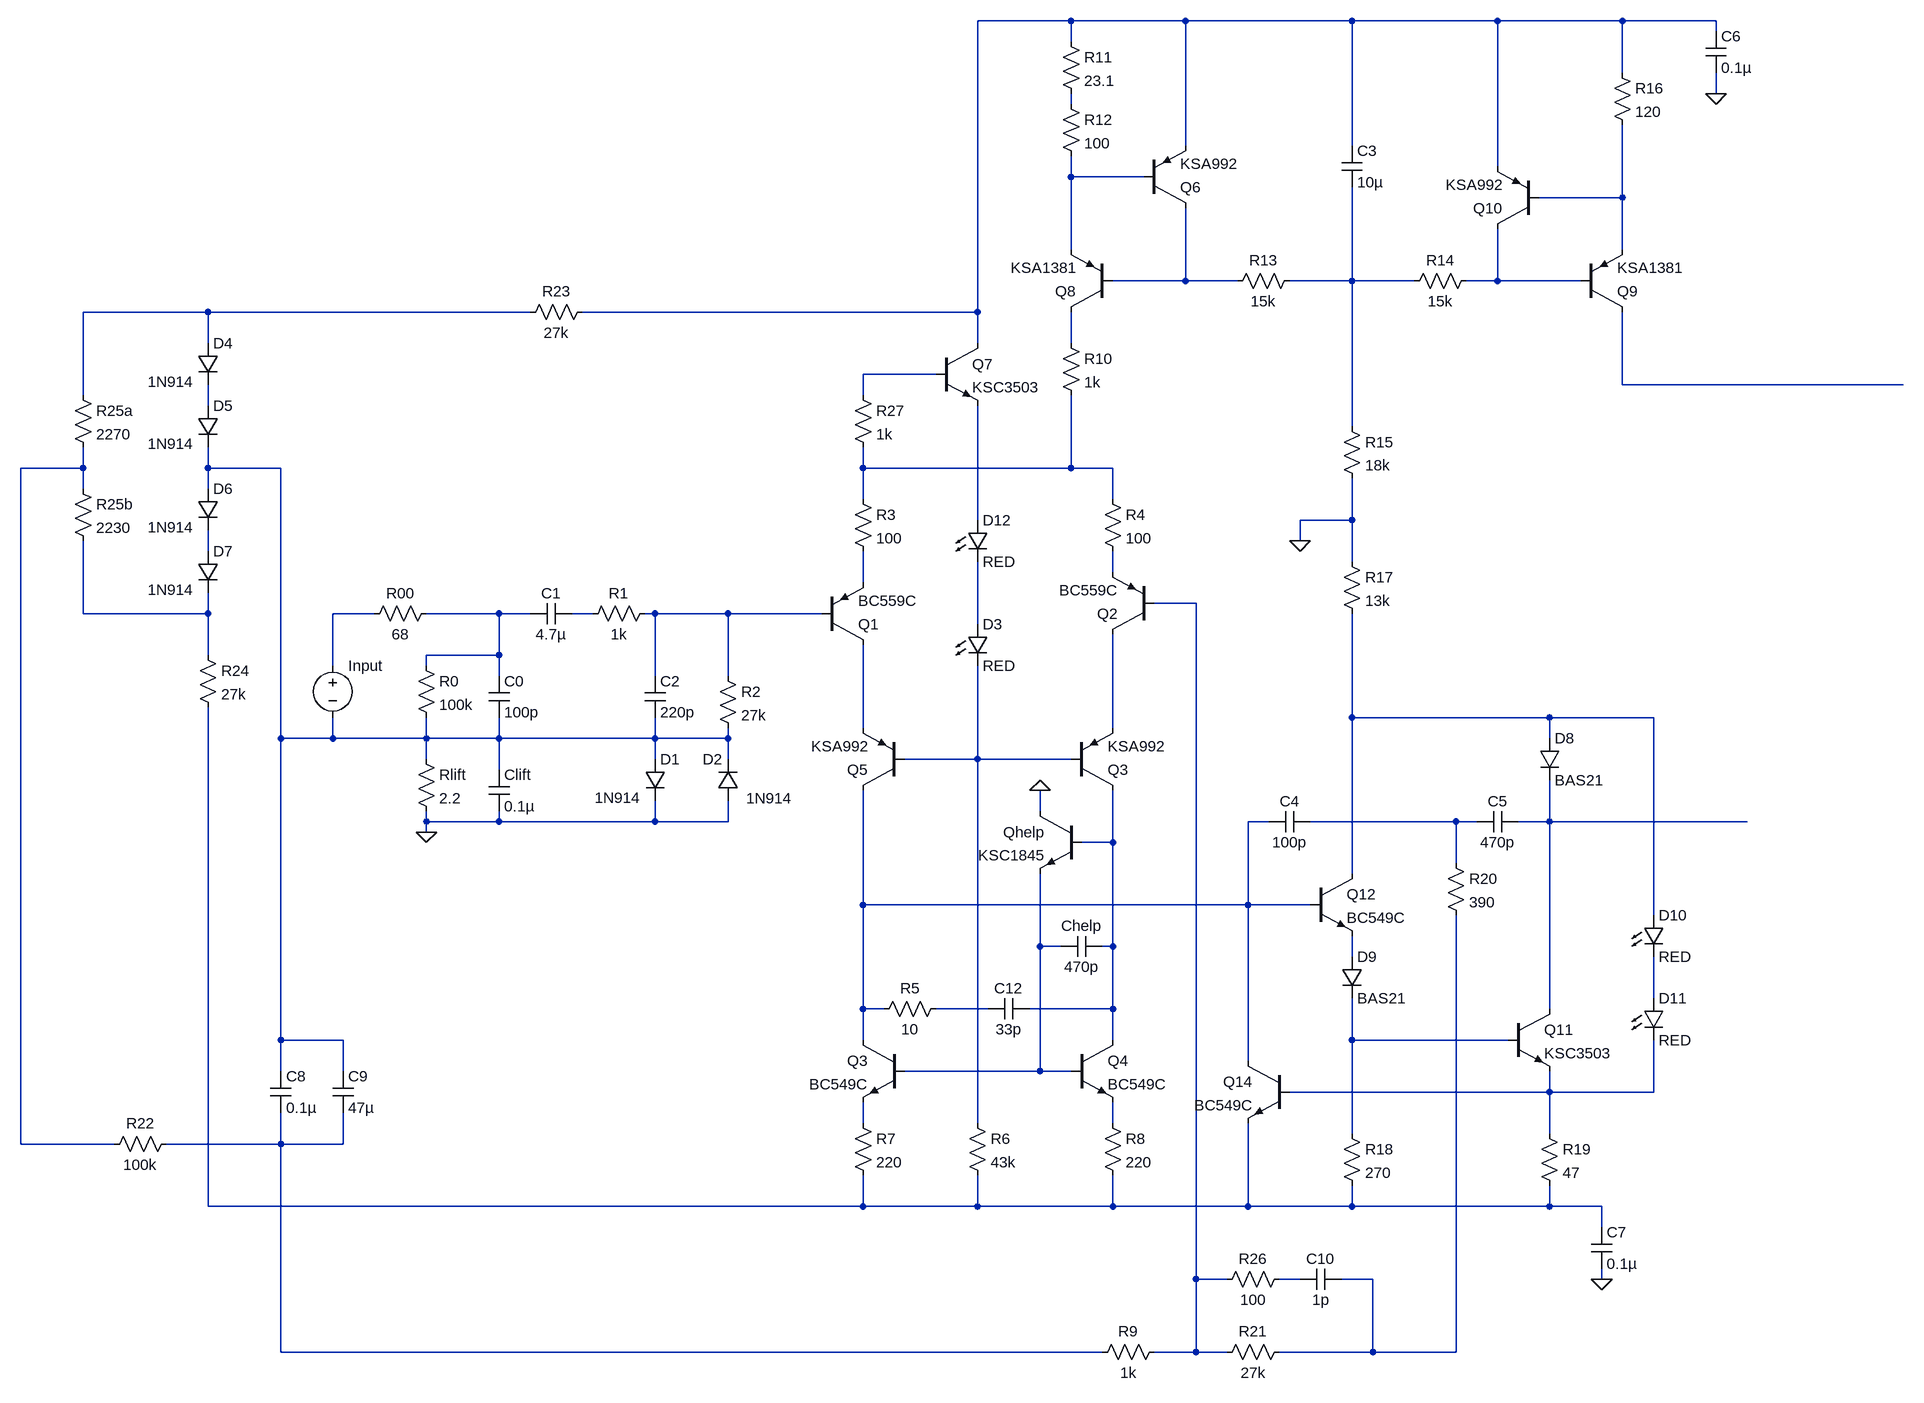
[diagram p0: schematic Wolverine.asc]
Wolverine.asc, the LTspice schematic file:
Version 4
SHEET 1 2548 1248
WIRE 1264 -848 1120 -848
WIRE 1440 -848 1264 -848
WIRE 1696 -848 1440 -848
WIRE 1920 -848 1696 -848
WIRE 2112 -848 1920 -848
WIRE 2256 -848 2112 -848
WIRE 2256 -832 2256 -848
WIRE 1264 -816 1264 -848
WIRE 2112 -768 2112 -848
WIRE 2256 -736 2256 -768
WIRE 1264 -720 1264 -736
WIRE 1440 -656 1440 -848
WIRE 1696 -656 1696 -848
WIRE 1920 -624 1920 -848
WIRE 1264 -608 1264 -640
WIRE 1376 -608 1264 -608
WIRE 2112 -576 2112 -688
WIRE 2112 -576 1984 -576
WIRE 1264 -496 1264 -608
WIRE 2112 -496 2112 -576
WIRE 1440 -448 1440 -560
WIRE 1440 -448 1328 -448
WIRE 1520 -448 1440 -448
WIRE 1696 -448 1696 -592
WIRE 1696 -448 1600 -448
WIRE 1792 -448 1696 -448
WIRE 1920 -448 1920 -528
WIRE 1920 -448 1872 -448
WIRE 2048 -448 1920 -448
WIRE -64 -400 -256 -400
WIRE 432 -400 -64 -400
WIRE 1120 -400 1120 -848
WIRE 1120 -400 512 -400
WIRE -64 -352 -64 -400
WIRE 1120 -352 1120 -400
WIRE 1264 -352 1264 -400
WIRE 1056 -304 944 -304
WIRE 2112 -288 2112 -400
WIRE 2544 -288 2112 -288
WIRE -256 -272 -256 -400
WIRE 944 -272 944 -304
WIRE -64 -256 -64 -288
WIRE 1696 -224 1696 -448
WIRE -256 -160 -256 -192
WIRE -256 -160 -352 -160
WIRE -64 -160 -64 -192
WIRE 48 -160 -64 -160
WIRE 944 -160 944 -192
WIRE 1264 -160 1264 -272
WIRE 1264 -160 944 -160
WIRE 1328 -160 1264 -160
WIRE -256 -128 -256 -160
WIRE -64 -128 -64 -160
WIRE 944 -112 944 -160
WIRE 1328 -112 1328 -160
WIRE 1120 -80 1120 -256
WIRE 1696 -80 1696 -144
WIRE 1696 -80 1616 -80
WIRE 1616 -48 1616 -80
WIRE -64 -32 -64 -64
WIRE 1696 -16 1696 -80
WIRE 1328 0 1328 -32
WIRE 944 16 944 -32
WIRE 1456 48 1392 48
WIRE -256 64 -256 -48
WIRE -64 64 -64 32
WIRE -64 64 -256 64
WIRE 192 64 128 64
WIRE 384 64 272 64
WIRE 432 64 384 64
WIRE 528 64 496 64
WIRE 624 64 608 64
WIRE 736 64 624 64
WIRE 880 64 736 64
WIRE 1120 80 1120 -16
WIRE -64 128 -64 64
WIRE 384 128 384 64
WIRE 384 128 272 128
WIRE 128 144 128 64
WIRE 272 144 272 128
WIRE 384 160 384 128
WIRE 624 160 624 64
WIRE 736 160 736 64
WIRE 1696 224 1696 64
WIRE 2000 224 1696 224
WIRE 2160 224 2000 224
WIRE 944 240 944 112
WIRE 1328 240 1328 96
WIRE 48 256 48 -160
WIRE 128 256 128 224
WIRE 128 256 48 256
WIRE 272 256 272 224
WIRE 272 256 128 256
WIRE 384 256 384 224
WIRE 384 256 272 256
WIRE 624 256 624 224
WIRE 624 256 384 256
WIRE 736 256 736 240
WIRE 736 256 624 256
WIRE 2000 256 2000 224
WIRE 272 288 272 256
WIRE 624 288 624 256
WIRE 736 288 736 256
WIRE 1120 288 1120 144
WIRE 1120 288 1008 288
WIRE 1264 288 1120 288
WIRE 384 304 384 256
WIRE 1216 368 1216 336
WIRE 272 384 272 368
WIRE 384 384 384 368
WIRE 384 384 272 384
WIRE 624 384 624 352
WIRE 624 384 384 384
WIRE 736 384 736 352
WIRE 736 384 624 384
WIRE 1568 384 1536 384
WIRE 1856 384 1632 384
WIRE 1888 384 1856 384
WIRE 2000 384 2000 320
WIRE 2000 384 1952 384
WIRE 2304 384 2000 384
WIRE 272 400 272 384
WIRE 1328 416 1328 336
WIRE 1328 416 1280 416
WIRE 1856 448 1856 384
WIRE 1696 464 1696 224
WIRE 944 512 944 336
WIRE 1536 512 1536 384
WIRE 1536 512 944 512
WIRE 1632 512 1536 512
WIRE 2160 528 2160 224
WIRE 1216 576 1216 464
WIRE 1248 576 1216 576
WIRE 1328 576 1328 416
WIRE 1328 576 1312 576
WIRE 1696 592 1696 560
WIRE 2160 656 2160 592
WIRE 944 672 944 512
WIRE 976 672 944 672
WIRE 1136 672 1056 672
WIRE 1328 672 1328 576
WIRE 1328 672 1200 672
WIRE 2000 672 2000 384
WIRE 48 720 48 256
WIRE 144 720 48 720
WIRE 944 720 944 672
WIRE 1328 720 1328 672
WIRE 1696 720 1696 656
WIRE 1936 720 1696 720
WIRE 1536 752 1536 512
WIRE 48 768 48 720
WIRE 144 768 144 720
WIRE 1216 768 1216 576
WIRE 1216 768 1008 768
WIRE 1264 768 1216 768
WIRE 2000 800 2000 768
WIRE 2000 800 1600 800
WIRE 2160 800 2160 720
WIRE 2160 800 2000 800
WIRE 944 848 944 816
WIRE 1120 848 1120 288
WIRE 1328 848 1328 816
WIRE 1696 864 1696 720
WIRE 2000 864 2000 800
WIRE -352 880 -352 -160
WIRE -208 880 -352 880
WIRE 48 880 48 832
WIRE 48 880 -128 880
WIRE 144 880 144 832
WIRE 144 880 48 880
WIRE -64 976 -64 208
WIRE 944 976 944 928
WIRE 944 976 -64 976
WIRE 1120 976 1120 928
WIRE 1120 976 944 976
WIRE 1328 976 1328 928
WIRE 1328 976 1120 976
WIRE 1536 976 1536 848
WIRE 1536 976 1328 976
WIRE 1696 976 1696 944
WIRE 1696 976 1536 976
WIRE 2000 976 2000 944
WIRE 2000 976 1696 976
WIRE 2080 976 2000 976
WIRE 2080 1008 2080 976
WIRE 1456 1088 1456 48
WIRE 1504 1088 1456 1088
WIRE 1616 1088 1584 1088
WIRE 1728 1088 1680 1088
WIRE 2080 1088 2080 1072
WIRE 48 1200 48 880
WIRE 1312 1200 48 1200
WIRE 1456 1200 1456 1088
WIRE 1456 1200 1392 1200
WIRE 1504 1200 1456 1200
WIRE 1728 1200 1728 1088
WIRE 1728 1200 1584 1200
WIRE 1856 1200 1856 528
WIRE 1856 1200 1728 1200
FLAG 272 400 0
FLAG 1216 336 0
FLAG 1616 -48 0
FLAG 2256 -736 0
FLAG 2080 1088 0
SYMBOL voltage 128 128 R0
WINDOW 3 24 96 Invisible 2
WINDOW 123 0 0 Left 0
WINDOW 39 0 0 Left 0
SYMATTR InstName Input
SYMATTR Value SINE(0 1 1k)
SYMBOL res 288 48 R90
WINDOW 0 0 56 VBottom 2
WINDOW 3 32 56 VTop 2
SYMATTR InstName R00
SYMATTR Value 68
SYMBOL res 256 128 R0
SYMATTR InstName R0
SYMATTR Value 100k
SYMBOL cap 368 160 R0
SYMATTR InstName C0
SYMATTR Value 100p
SYMBOL cap 496 48 R90
WINDOW 0 0 32 VBottom 2
WINDOW 3 32 32 VTop 2
SYMATTR InstName C1
SYMATTR Value 4.7µ
SYMBOL res 624 48 R90
WINDOW 0 0 56 VBottom 2
WINDOW 3 32 56 VTop 2
SYMATTR InstName R1
SYMATTR Value 1k
SYMBOL cap 608 160 R0
SYMATTR InstName C2
SYMATTR Value 220p
SYMBOL res 720 144 R0
SYMATTR InstName R2
SYMATTR Value 27k
SYMBOL pnp 880 112 M180
SYMATTR InstName Q1
SYMATTR Value BC559C
SYMBOL res 256 272 R0
SYMATTR InstName Rlift
SYMATTR Value 2.2
SYMBOL cap 368 304 R0
SYMATTR InstName Clift
SYMATTR Value 0.1µ
SYMBOL diode 608 288 R0
WINDOW 3 -77 59 Left 2
SYMATTR InstName D1
SYMATTR Value 1N914
SYMBOL diode 752 352 R180
WINDOW 0 24 64 Left 2
WINDOW 3 -83 4 Left 2
SYMATTR InstName D2
SYMATTR Value 1N914
SYMBOL pnp 1008 336 R180
SYMATTR InstName Q5
SYMATTR Value KSA992
SYMBOL res 928 -128 R0
SYMATTR InstName R3
SYMATTR Value 100
SYMBOL pnp 1392 96 R180
SYMATTR InstName Q2
SYMATTR Value BC559C
SYMBOL pnp 1264 336 M180
SYMATTR InstName Q3
SYMATTR Value KSA992
SYMBOL res 1312 -128 R0
SYMATTR InstName R4
SYMATTR Value 100
SYMBOL npn 1056 -352 R0
SYMATTR InstName Q7
SYMATTR Value KSC3503
SYMBOL res 928 -288 R0
SYMATTR InstName R27
SYMATTR Value 1k
SYMBOL LED 1104 -80 R0
SYMATTR InstName D12
SYMATTR Value RED
SYMATTR Description Diode
SYMATTR Type diode
SYMBOL LED 1104 80 R0
SYMATTR InstName D3
SYMATTR Value RED
SYMATTR Description Diode
SYMATTR Type diode
SYMBOL npn 1280 368 M0
SYMATTR InstName Qhelp
SYMATTR Value KSC1845
SYMBOL cap 1312 560 R90
WINDOW 0 0 32 VBottom 2
WINDOW 3 32 32 VTop 2
SYMATTR InstName Chelp
SYMATTR Value 470p
SYMBOL res 1072 656 R90
WINDOW 0 0 56 VBottom 2
WINDOW 3 32 56 VTop 2
SYMATTR InstName R5
SYMATTR Value 10
SYMBOL cap 1200 656 R90
WINDOW 0 0 32 VBottom 2
WINDOW 3 32 32 VTop 2
SYMATTR InstName C12
SYMATTR Value 33p
SYMBOL npn 1008 720 M0
SYMATTR InstName Q3
SYMATTR Value BC549C
SYMBOL npn 1264 720 R0
SYMATTR InstName Q4
SYMATTR Value BC549C
SYMBOL res 928 832 R0
SYMATTR InstName R7
SYMATTR Value 220
SYMBOL res 1312 832 R0
SYMATTR InstName R8
SYMATTR Value 220
SYMBOL res 1104 832 R0
SYMATTR InstName R6
SYMATTR Value 43k
SYMBOL res 1248 -368 R0
SYMATTR InstName R10
SYMATTR Value 1k
SYMBOL pnp 1328 -400 R180
SYMATTR InstName Q8
SYMATTR Value KSA1381
SYMBOL pnp 1376 -560 M180
SYMATTR InstName Q6
SYMATTR Value KSA992
SYMBOL res 1248 -736 R0
SYMATTR InstName R12
SYMATTR Value 100
SYMBOL res 1248 -832 R0
SYMATTR InstName R11
SYMATTR Value 23.1
SYMBOL res 528 -416 R90
WINDOW 0 0 56 VBottom 2
WINDOW 3 32 56 VTop 2
SYMATTR InstName R23
SYMATTR Value 27k
SYMBOL npn 1632 464 R0
SYMATTR InstName Q12
SYMATTR Value BC549C
SYMBOL diode 1680 592 R0
SYMATTR InstName D9
SYMATTR Value BAS21
SYMBOL cap 1632 368 R90
WINDOW 0 0 32 VBottom 2
WINDOW 3 32 32 VTop 2
SYMATTR InstName C4
SYMATTR Value 100p
SYMBOL res 1680 -32 R0
SYMATTR InstName R17
SYMATTR Value 13k
SYMBOL res 1680 -240 R0
SYMATTR InstName R15
SYMATTR Value 18k
SYMBOL res 1616 -464 R90
WINDOW 0 0 56 VBottom 2
WINDOW 3 32 56 VTop 2
SYMATTR InstName R13
SYMATTR Value 15k
SYMBOL cap 1680 -656 R0
SYMATTR InstName C3
SYMATTR Value 10µ
SYMBOL res 1888 -464 R90
WINDOW 0 0 56 VBottom 2
WINDOW 3 32 56 VTop 2
SYMATTR InstName R14
SYMATTR Value 15k
SYMBOL pnp 1984 -528 R180
SYMATTR InstName Q10
SYMATTR Value KSA992
SYMBOL pnp 2048 -400 M180
SYMATTR InstName Q9
SYMATTR Value KSA1381
SYMBOL res 2096 -784 R0
SYMATTR InstName R16
SYMATTR Value 120
SYMBOL cap 2240 -832 R0
SYMATTR InstName C6
SYMATTR Value 0.1µ
SYMBOL npn 1600 752 M0
SYMATTR InstName Q14
SYMATTR Value BC549C
SYMBOL res 1680 848 R0
SYMATTR InstName R18
SYMATTR Value 270
SYMBOL npn 1936 672 R0
SYMATTR InstName Q11
SYMATTR Value KSC3503
SYMBOL res 1840 432 R0
SYMATTR InstName R20
SYMATTR Value 390
SYMBOL res 1984 848 R0
SYMATTR InstName R19
SYMATTR Value 47
SYMBOL LED 2144 656 R0
SYMATTR InstName D11
SYMATTR Value RED
SYMATTR Description Diode
SYMATTR Type diode
SYMBOL LED 2144 528 R0
SYMATTR InstName D10
SYMATTR Value RED
SYMATTR Description Diode
SYMATTR Type diode
SYMBOL cap 1952 368 R90
WINDOW 0 0 32 VBottom 2
WINDOW 3 32 32 VTop 2
SYMATTR InstName C5
SYMATTR Value 470p
SYMBOL diode 1984 256 R0
SYMATTR InstName D8
SYMATTR Value BAS21
SYMBOL res 1600 1072 R90
WINDOW 0 0 56 VBottom 2
WINDOW 3 32 56 VTop 2
SYMATTR InstName R26
SYMATTR Value 100
SYMBOL cap 1680 1072 R90
WINDOW 0 0 32 VBottom 2
WINDOW 3 32 32 VTop 2
SYMATTR InstName C10
SYMATTR Value 1p
SYMBOL res 1600 1184 R90
WINDOW 0 0 56 VBottom 2
WINDOW 3 32 56 VTop 2
SYMATTR InstName R21
SYMATTR Value 27k
SYMBOL cap 2064 1008 R0
SYMATTR InstName C7
SYMATTR Value 0.1µ
SYMBOL res 1408 1184 R90
WINDOW 0 0 56 VBottom 2
WINDOW 3 32 56 VTop 2
SYMATTR InstName R9
SYMATTR Value 1k
SYMBOL cap 32 768 R0
SYMATTR InstName C8
SYMATTR Value 0.1µ
SYMBOL cap 128 768 R0
SYMATTR InstName C9
SYMATTR Value 47µ
SYMBOL diode -80 -352 R0
WINDOW 3 -77 59 Left 2
SYMATTR InstName D4
SYMATTR Value 1N914
SYMBOL diode -80 -256 R0
WINDOW 3 -77 59 Left 2
SYMATTR InstName D5
SYMATTR Value 1N914
SYMBOL diode -80 -128 R0
WINDOW 3 -77 59 Left 2
SYMATTR InstName D6
SYMATTR Value 1N914
SYMBOL diode -80 -32 R0
WINDOW 3 -77 59 Left 2
SYMATTR InstName D7
SYMATTR Value 1N914
SYMBOL res -80 112 R0
SYMATTR InstName R24
SYMATTR Value 27k
SYMBOL res -112 864 R90
WINDOW 0 0 56 VBottom 2
WINDOW 3 32 56 VTop 2
SYMATTR InstName R22
SYMATTR Value 100k
SYMBOL res -272 -144 R0
SYMATTR InstName R25b
SYMATTR Value 2230
SYMBOL res -272 -288 R0
SYMATTR InstName R25a
SYMATTR Value 2270

The netlist it stands for:
* Wolverine.asc
V§Input N022 N014 SINE(0 1 1k)
R00 N023 N022 68
R0 N023 N014 100k
C0 N023 N014 100p
C1 N024 N023 4.7µ
R1 N025 N024 1k
C2 N025 N014 220p
R2 N025 N014 27k
Q1 N028 N025 N019 0 BC559C
Rlift N014 0 2.2
Clift N014 0 0.1µ
D1 N014 0 1N914
D2 0 N014 1N914
Q5 N031 N030 N028 0 KSA992
R3 N015 N019 100
Q2 N029 N020 N018 0 BC559C
Q3 N034 N030 N029 0 KSA992
R4 N015 N018 100
Q7 N001 N010 N016 0 KSC3503
R27 N010 N015 1k
D12 N016 N026 RED
D3 N026 N030 RED
Qhelp 0 N034 N035 0 KSC1845
Chelp N034 N035 470p
R5 N038 N031 10
C12 N034 N038 33p
Q3 N031 N035 N041 0 BC549C
Q4 N034 N035 N042 0 BC549C
R7 N041 N044 220
R8 N042 N044 220
R6 N030 N044 43k
R10 N009 N015 1k
Q8 N009 N005 N003 0 KSA1381
Q6 N005 N003 N001 0 KSA992
R12 N002 N003 100
R11 N001 N002 23.1
R23 N001 N008 27k
Q12 N027 N031 N036 0 BC549C
D9 N036 N039 BAS21
C4 N032 N031 100p
R17 0 N027 13k
R15 N006 0 18k
R13 N006 N005 15k
C3 N001 N006 10µ
R14 N007 N006 15k
Q10 N007 N004 N001 0 KSA992
Q9 N011 N007 N004 0 KSA1381
R16 N001 N004 120
C6 N001 0 0.1µ
Q14 N031 N040 N044 0 BC549C
R18 N039 N044 270
Q11 N033 N039 N040 0 KSC3503
R20 N032 N046 390
R19 N040 N044 47
D11 N037 N040 RED
D10 N027 N037 RED
C5 N033 N032 470p
D8 N027 N033 BAS21
R26 N045 N020 100
C10 N046 N045 1p
R21 N046 N020 27k
C7 N044 0 0.1µ
R9 N020 N043 1k
C8 N014 N043 0.1µ
C9 N014 N043 47µ
D4 N008 N012 1N914
D5 N012 N014 1N914
D6 N014 N017 1N914
D7 N017 N021 1N914
R24 N021 N044 27k
R22 N043 N013 100k
R25b N013 N021 2230
R25a N008 N013 2270
.model D D
.lib standard.dio
.model NPN NPN
.model PNP PNP
.lib standard.bjt
.backanno
.end